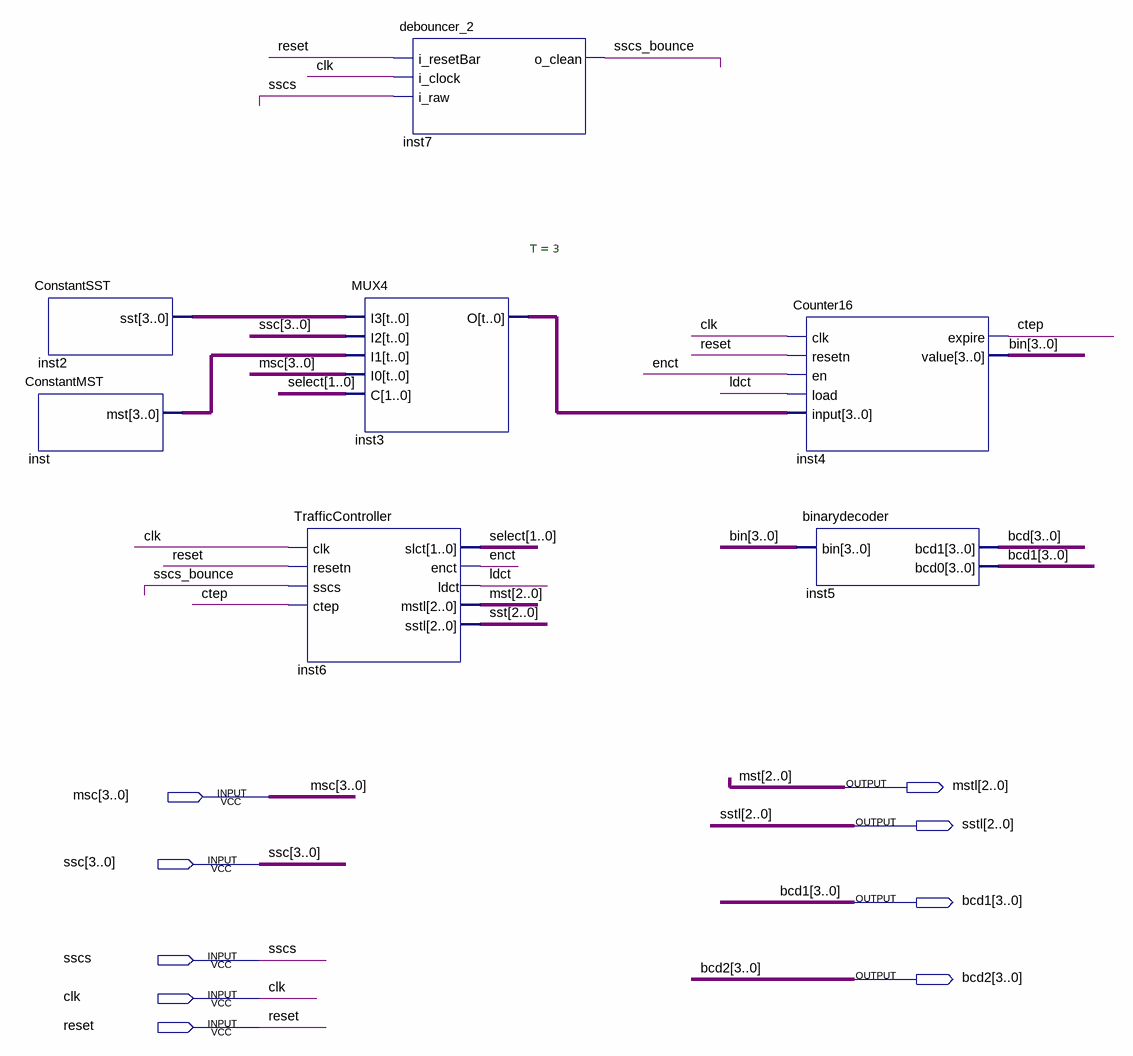
[diagram p0: schematic sheet]
// Quartus schematic trafficlight.bdf as structural Verilog: 7 symbols, 9 pins
module trafficlight (
  input  [3:0] msc,
  input  [3:0] ssc,
  input  sscs,
  input  clk,
  input  reset,
  output [2:0] mstl,
  output [2:0] sstl,
  output [3:0] bcd1,
  output [3:0] bcd2
);

  wire ctep, enct, ldct, sscs_bounce;
  wire [1:0] select;
  wire [2:0] sst;
  wire [3:0] bcd, bin, inst2_sst, inst3_o, inst_mst;

  ConstantMST inst (.mst(inst_mst));
  ConstantSST inst2 (.sst(inst2_sst));
  TrafficController inst6 (
    .clk(clk), .resetn(reset), .sscs(sscs_bounce), .ctep(ctep), .slct(select), .enct(enct), .ldct(ldct),
    .mstl(mstl), .sstl(sst));
  debouncer_2 inst7 (.i_resetBar(reset), .i_clock(clk), .i_raw(sscs), .o_clean(sscs_bounce));
  MUX4 #(.T(3)) inst3 (.I3(inst2_sst), .I2(ssc), .I1(inst_mst), .I0(msc), .C(select), .O(inst3_o));
  Counter16 inst4 (.clk(clk), .resetn(reset), .en(enct), .load(ldct), .\input (inst3_o), .expire(ctep), .value(bin));
  binarydecoder inst5 (.bin(bin), .bcd1(bcd), .bcd0(bcd1));

  // Other names for the same wires on the sheet: mst[2:0] = mstl
endmodule
